# Altium schematic sheet HMC472_SPF5189.SchDoc
size A2; SheetNumber: 1; SheetTotal: 1
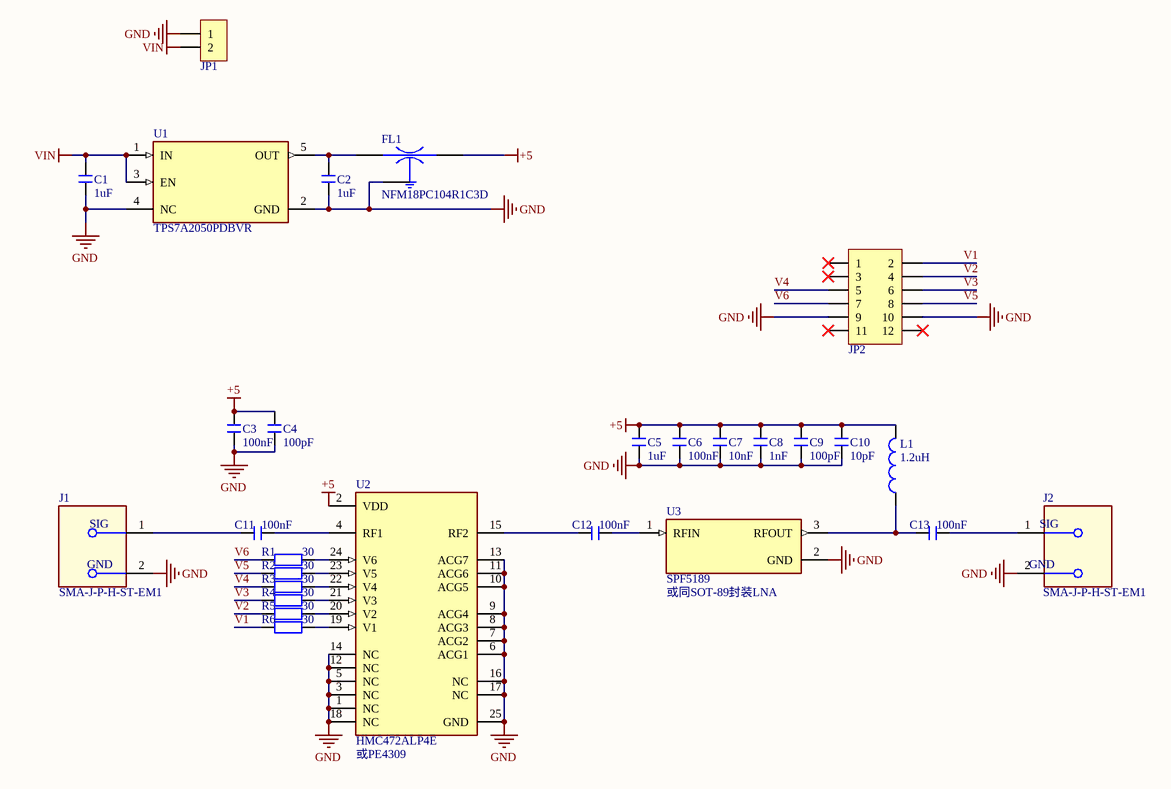
[diagram p0: HMC472_SPF5189.SchDoc]

## Parts
C1  1uF  [C 0603_L]
C2  1uF  [C 0603_L]
C3  100nF  [C 0603_L]
C4  100pF  [C 0603_L]
C5  1uF  [C 0603_L]
C6  100nF  [C 0603_L]
C7  10nF  [C 0603_L]
C8  1nF  [C 0603_L]
C9  100pF  [C 0603_L]
C10  10pF  [C 0603_L]
C11  100nF  [C 0603_L]
C12  100nF  [C 0603_L]
C13  100nF  [C 0603_L]
FL1  NFM18PC104R1C3D  [FIL_NFM18PC104R1C3D]
J1  SMA-J-P-H-ST-EM1  [FP-SMA-J-P-H-ST-EM1-MFG]
J2  SMA-J-P-H-ST-EM1  [FP-SMA-J-P-H-ST-EM1-MFG]
JP1  HDR-1X2  [KF2510-LI-2P]  (value not drawn)
JP2  Header 6X2  [HDR2.54-WI-2x6P]  (value not drawn)
L1  1.2uH  [IND-SMD_L2.9-W2.8]
R1  30  [R 0402_L]
R2  30  [R 0402_L]
R3  30  [R 0402_L]
R4  30  [R 0402_L]
R5  30  [R 0402_L]
R6  30  [R 0402_L]
U1  TPS7A2050PDBVR  [FP-DBV0005A-IPC_C]
U2  HMC472ALP4E  [FP-HMC472ALP4E-IPC_A]
U3  SPF5189  [FP-RK-3-MFG]

## Nets
+5: C3.2 C4.2 C5.2 C6.2 C7.2 C8.2 C9.2 C10.2 FL1.3(OUT) L1.2 U2.2(VDD)
GND: C1.1 C2.1 C3.1 C4.1 C5.1 C6.1 C7.1 C8.1 C9.1 C10.1 FL1.2(GND) J1.2(MNT_1) J2.2(MNT_1) JP1.1 JP2.9 JP2.10 U1.2(GND) U1.4(NC) U2.1(NC) U2.3(NC) U2.5(NC) U2.6(ACG1) U2.7(ACG2) U2.8(ACG3) U2.9(ACG4) U2.10(ACG5) U2.11(ACG6) U2.12(NC) U2.13(ACG7) U2.14(NC) U2.16(NC) U2.17(NC) U2.18(NC) U2.25(GND) U3.2(GND)
VIN: C1.2 JP1.2 U1.1(IN) U1.3(EN)
V1: JP2.2 R6.1
V2: JP2.4 R5.1
V3: JP2.6 R4.1
V4: JP2.5 R3.1
V5: JP2.8 R2.1
V6: JP2.7 R1.1
NetC2_2: C2.2 FL1.1(IN) U1.5(OUT)
NetC11_1: C11.1 J1.1
NetC11_2: C11.2 U2.4(RF1)
NetC12_1: C12.1 U2.15(RF2)
NetC12_2: C12.2 U3.1(RFIN)
NetC13_1: C13.1 L1.1 U3.3(RFOUT)
NetC13_2: C13.2 J2.1
NetR1_2: R1.2 U2.24(V6)
NetR2_2: R2.2 U2.23(V5)
NetR3_2: R3.2 U2.22(V4)
NetR4_2: R4.2 U2.21(V3)
NetR5_2: R5.2 U2.20(V2)
NetR6_2: R6.2 U2.19(V1)

Not connected (* = marked no-connect by the designer): JP2 1* 3* 11* 12*

## Notes on the sheet
- (near U3) 或同SOT-89封装LNA
- (near U2) 或PE4309
- (in symbol CMP-02754-000006-1) SIG; GND

## Library data of the parts
C1-C13 = C: 贴片电容; 淘宝ID: 小糖豆的小窝窝; BOM名称: 贴片电容; 下单链接: https://item.taobao.com/item.htm?ft=t&id=613637044352
FL1 = NFM18PC104R1C3D: SMD Capacitor with Capacitance: 0.10uF Tol. 20%. Rated Voltage: 16Vdc; MF: Murata; Digi-Key_Part_Number: 490-6969-1-ND; SnapEDA_Link: https://www.snapeda.com/parts/NFM18PC104R1C3D/Murata/view-part/4375738/?ref=snap; Package: NONSTANDARD; MP: NFM18PC104R1C3D; Digi-Key_Purchase_URL: https://www.digikey.com/product-detail/en/murata-electronics/NFM18PC104R1C3D/490-6969-1-ND/3846166?utm_source=snapeda&utm_medium=aggregator&utm_campaign=symbol; Value: *
J1 J2 = CMP-02754-000006-1: CONN SMA JACK STR 50OHM EDGE MNT; Center Contact Plating: Gold; Voltage Rating: 335V; Impedance: 50R; Max Frequency: 6GHz; Body Material: Brass; Dielectric Material: PTFE; Connector Type: SMA; Series: SMA; Fastening Type: Threaded; Depth: 13.33mm; Max Operating Temperature: 125°C; Termination: Solder; Length: 6.35mm; Radiation Hardening: No; RoHS Compliant: Yes; Insulation Material: Polytetrafluoroethylene; Min Operating Temperature: -65°C; Packaging: Tray; Housing Color: Gold; Body Plating: Gold; Mount: Edge; Contact Material: Copper; Orientation: Straight; Package Quantity: 1; Contact Plating: Gold; Case/Package: SMA
JP1 = Header 2: 2P接插件; 淘宝ID: 小糖豆的小窝窝; BOM名称: 2P接插件; 下单链接: https://item.taobao.com/item.htm?ft=t&id=613637044352
JP2 = Header  6X2: 6*2P接插件; 淘宝ID: 小糖豆的小窝窝; BOM名称: 6*2P接插件; 下单链接: https://item.taobao.com/item.htm?ft=t&id=613637044352
L1 = L: 小功率贴片电感; BOM名称: 小功率贴片电感; 下单链接: https://item.taobao.com/item.htm?ft=t&id=613637044352
R1-R6 = R: 贴片电阻; 淘宝ID: 小糖豆的小窝窝; BOM名称: 贴片电阻; 下单链接: https://item.taobao.com/item.htm?ft=t&id=613637044352
U1 = TPS7A2050: 300-mA, ultra-low-noise, low-IQ, low-dropout (LDO) linear regulator with high PSRR 5-SOT-23 -40 to 125; RoHS Compliant: Yes
U2 = HMC472ALP4E: RF ATTENUATOR 31.5DB 50OHM 24QFN; Manufacturer: Analog Devices; Standoff Height: 0mm; Max Frequency: 3.8GHz; Temperature Range High: +85°C; Ipc Land Pattern Name: QFN50P400X400X90-24; Category: IC; Automotive: No; Package: LFCSP_VQ; Device Class L3: unset; Height: 1mm; Device Class L1: Integrated Circuits (ICs); Octopart: https://octopart.com/hmc472alp4e-analog+devices-51966954; Manufacturer Part Number: HMC472ALP4E; Lead Free: Yes; Device Class L2: RF Semiconductors and Devices; RoHS: TRUE; Footprint Url: https://www.analog.com/media/en/package-pcb-resources/package/pkg_pdf/hittite-legacy-packages/HCP-24-2.pdf; Temperature Range Low: -40°C; Mouser Description: Attenuators 6 Bit 0.5 LSB dig atten; Digikey Description: RF ATTENUATOR 31.5DB 50OHM 24QFN; ComponentLink2URL: https://www.analog.com/media/en/technical-documentation/data-sheets/hmc472a.pdf; Temperature: -40°C to +85°C; ComponentLink2Description: Datasheet
U3 = HMC480: IC RF AMP GP 0HZ-5GHZ SOT89; Max Supply Voltage: 8V; Operating Supply Current: 82mA; Number of Channels: 1; Max Frequency: 5GHz; Operating Frequency: DC to 5 GHz; Max Power Dissipation: 536mW; Min Supply Voltage: 6V; P1dB: 20dBm; Gain: 19dB; Noise Figure: 4dB; Min Operating Temperature: -40°C; Weight: 0.004603oz; Case/Package: TO-243AA; Package Quantity: 50; RoHS Compliant: Yes; Mount: Surface Mount; Operating Supply Voltage: 8V; Contact Plating: Tin; Series: -; Packaging: Strip; Max Operating Temperature: 85°C; Number of Pins: 3; Lead Free: Contains Lead